# EAGLE design equ (EAGLE 9.1.2)
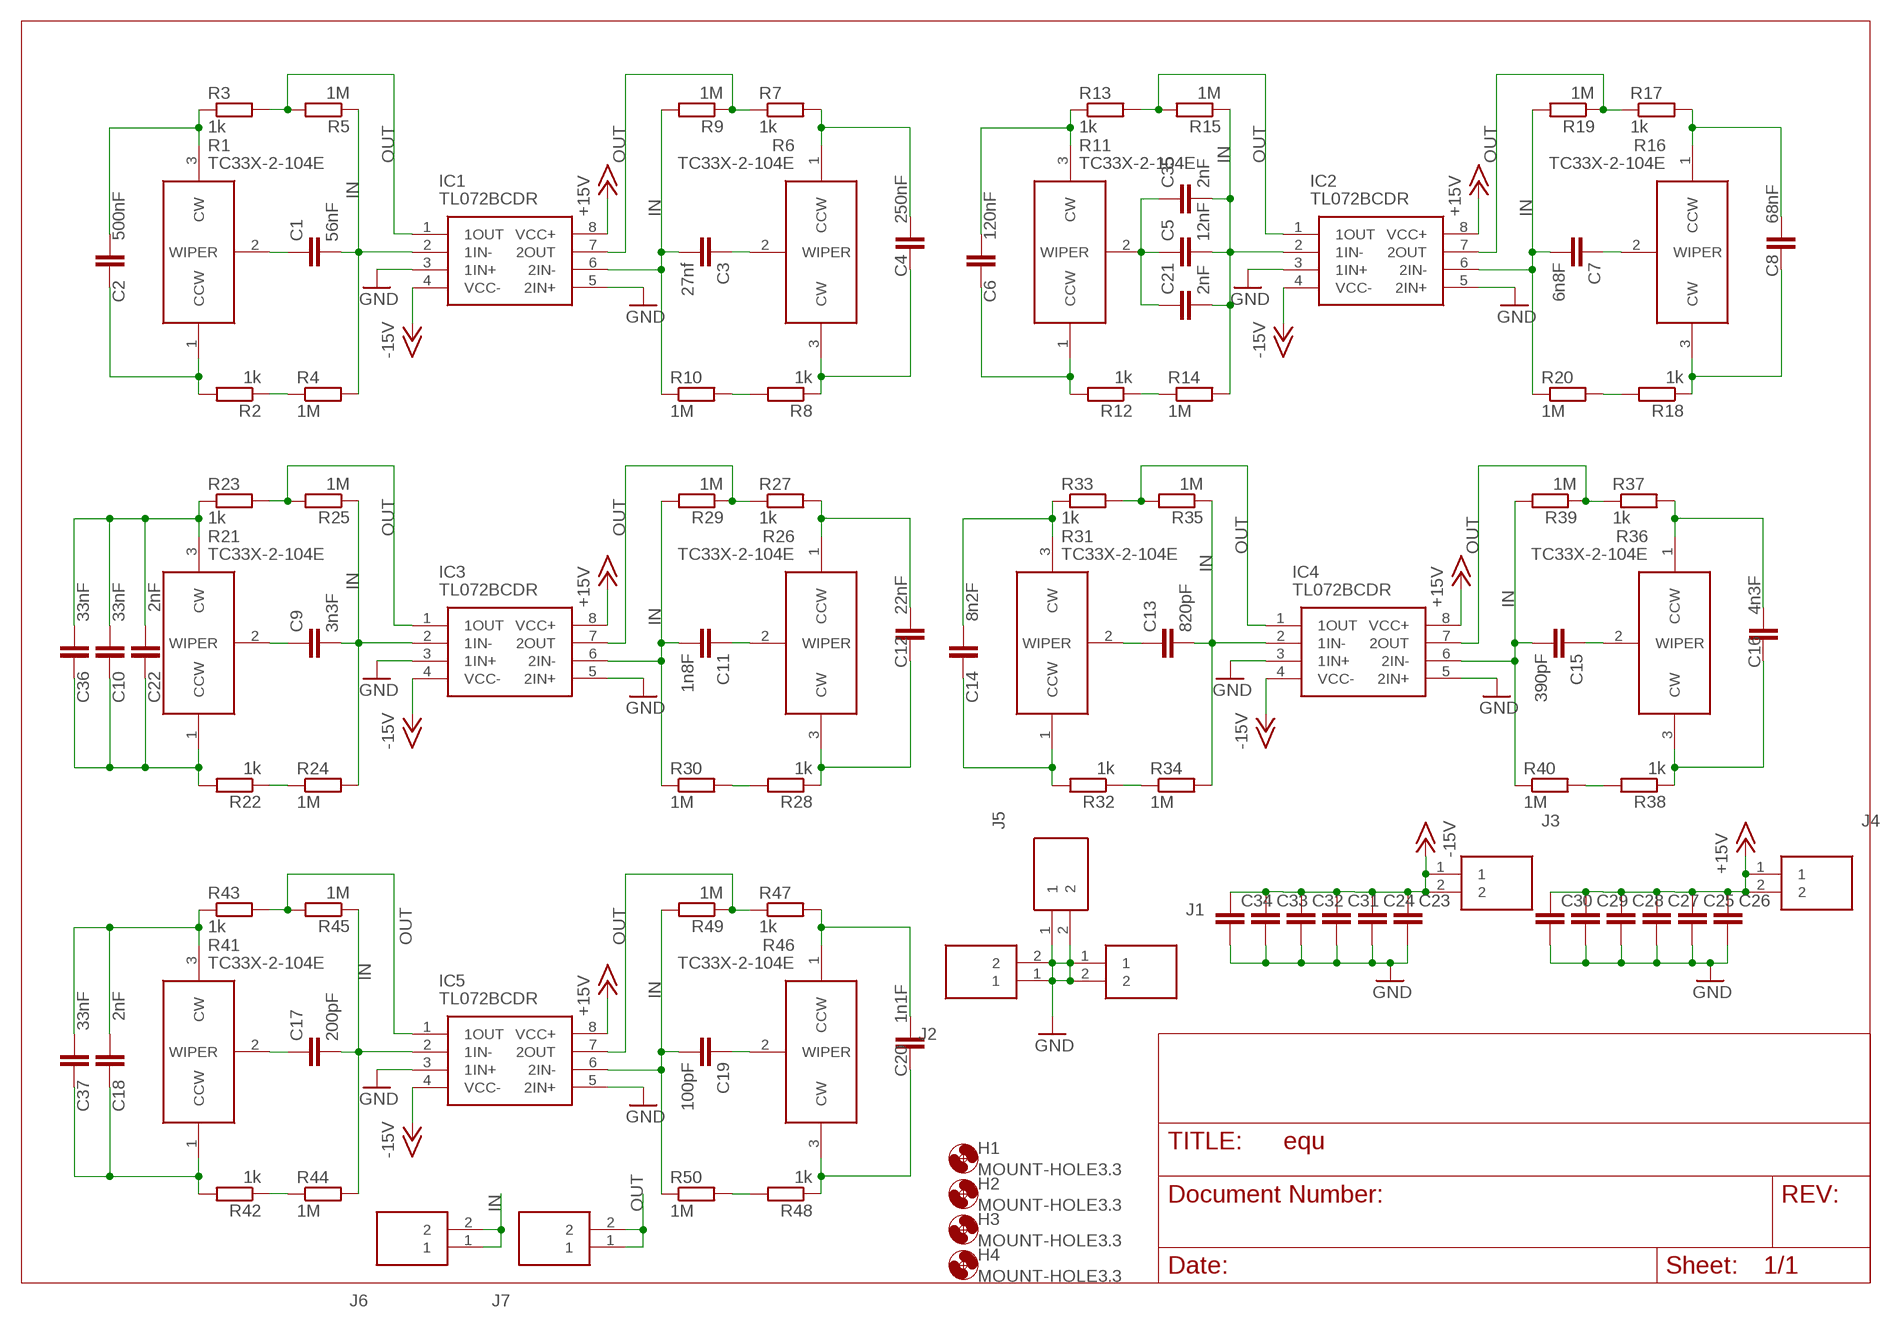
[diagram p0: schematic, sheet 1]

## Parts
C1  56nF  C-EUC0805  [C0805]
C2  500nF  C-EUC0805  [C0805]
C3  27nf  C-EUC0805  [C0805]
C4  250nF  C-EUC0805  [C0805]
C5  12nF  C-EUC0805  [C0805]
C6  120nF  C-EUC0805  [C0805]
C7  6n8F  C-EUC0805  [C0805]
C8  68nF  C-EUC0805  [C0805]
C9  3n3F  C-EUC0805  [C0805]
C10  33nF  C-EUC0805  [C0805]
C11  1n8F  C-EUC0805  [C0805]
C12  22nF  C-EUC0805  [C0805]
C13  820pF  C-EUC0805  [C0805]
C14  8n2F  C-EUC0805  [C0805]
C15  390pF  C-EUC0805  [C0805]
C16  4n3F  C-EUC0805  [C0805]
C17  200pF  C-EUC0805  [C0805]
C18  2nF  C-EUC0805  [C0805]
C19  100pF  C-EUC0805  [C0805]
C20  1n1F  C-EUC0805  [C0805]
C21  2nF  C-EUC0805  [C0805]
C22  2nF  C-EUC0805  [C0805]
C23  C-EUC0805  [C0805]
C24  C-EUC0805  [C0805]
C25  C-EUC0805  [C0805]
C26  C-EUC0805  [C0805]
C27  C-EUC0805  [C0805]
C28  C-EUC0805  [C0805]
C29  C-EUC0805  [C0805]
C30  C-EUC0805  [C0805]
C31  C-EUC0805  [C0805]
C32  C-EUC0805  [C0805]
C33  C-EUC0805  [C0805]
C34  C-EUC0805  [C0805]
C35  2nF  C-EUC0805  [C0805]
C36  33nF  C-EUC0805  [C0805]
C37  33nF  C-EUC0805  [C0805]
H1  MOUNT-HOLE3.3  [3,3]
H2  MOUNT-HOLE3.3  [3,3]
H3  MOUNT-HOLE3.3  [3,3]
H4  MOUNT-HOLE3.3  [3,3]
IC1  TL072BCDR  [SOIC127P600X175-8N]
IC2  TL072BCDR  [SOIC127P600X175-8N]
IC3  TL072BCDR  [SOIC127P600X175-8N]
IC4  TL072BCDR  [SOIC127P600X175-8N]
IC5  TL072BCDR  [SOIC127P600X175-8N]
J1  69190-402HLF  [HDRV2W90P0X254_1X2_508X241X858]
J2  69190-402HLF  [HDRV2W90P0X254_1X2_508X241X858]
J3  69190-402HLF  [HDRV2W90P0X254_1X2_508X241X858]
J4  69190-402HLF  [HDRV2W90P0X254_1X2_508X241X858]
J5  69190-402HLF  [HDRV2W90P0X254_1X2_508X241X858]
J6  69190-402HLF  [HDRV2W90P0X254_1X2_508X241X858]
J7  69190-402HLF  [HDRV2W90P0X254_1X2_508X241X858]
R1  TC33X-2-104E  [TC33X-2]
R2  1k  R-EU_R0805  [R0805]
R3  1k  R-EU_R0805  [R0805]
R4  1M  R-EU_R0805  [R0805]
R5  1M  R-EU_R0805  [R0805]
R6  TC33X-2-104E  [TC33X-2]
R7  1k  R-EU_R0805  [R0805]
R8  1k  R-EU_R0805  [R0805]
R9  1M  R-EU_R0805  [R0805]
R10  1M  R-EU_R0805  [R0805]
R11  TC33X-2-104E  [TC33X-2]
R12  1k  R-EU_R0805  [R0805]
R13  1k  R-EU_R0805  [R0805]
R14  1M  R-EU_R0805  [R0805]
R15  1M  R-EU_R0805  [R0805]
R16  TC33X-2-104E  [TC33X-2]
R17  1k  R-EU_R0805  [R0805]
R18  1k  R-EU_R0805  [R0805]
R19  1M  R-EU_R0805  [R0805]
R20  1M  R-EU_R0805  [R0805]
R21  TC33X-2-104E  [TC33X-2]
R22  1k  R-EU_R0805  [R0805]
R23  1k  R-EU_R0805  [R0805]
R24  1M  R-EU_R0805  [R0805]
R25  1M  R-EU_R0805  [R0805]
R26  TC33X-2-104E  [TC33X-2]
R27  1k  R-EU_R0805  [R0805]
R28  1k  R-EU_R0805  [R0805]
R29  1M  R-EU_R0805  [R0805]
R30  1M  R-EU_R0805  [R0805]
R31  TC33X-2-104E  [TC33X-2]
R32  1k  R-EU_R0805  [R0805]
R33  1k  R-EU_R0805  [R0805]
R34  1M  R-EU_R0805  [R0805]
R35  1M  R-EU_R0805  [R0805]
R36  TC33X-2-104E  [TC33X-2]
R37  1k  R-EU_R0805  [R0805]
R38  1k  R-EU_R0805  [R0805]
R39  1M  R-EU_R0805  [R0805]
R40  1M  R-EU_R0805  [R0805]
R41  TC33X-2-104E  [TC33X-2]
R42  1k  R-EU_R0805  [R0805]
R43  1k  R-EU_R0805  [R0805]
R44  1M  R-EU_R0805  [R0805]
R45  1M  R-EU_R0805  [R0805]
R46  TC33X-2-104E  [TC33X-2]
R47  1k  R-EU_R0805  [R0805]
R48  1k  R-EU_R0805  [R0805]
R49  1M  R-EU_R0805  [R0805]
R50  1M  R-EU_R0805  [R0805]

## Nets
+15V: C25.1 C26.1 C27.1 C28.1 C29.1 C30.1 IC1.8(VCC+) IC2.8(VCC+) IC3.8(VCC+) IC4.8(VCC+) IC5.8(VCC+) J4.1 J4.2
-15V: C23.1 C24.1 C31.1 C32.1 C33.1 C34.1 IC1.4(VCC-) IC2.4(VCC-) IC3.4(VCC-) IC4.4(VCC-) IC5.4(VCC-) J3.1 J3.2
GND: C23.2 C24.2 C25.2 C26.2 C27.2 C28.2 C29.2 C30.2 C31.2 C32.2 C33.2 C34.2 IC1.3(1IN+) IC1.5(2IN+) IC2.3(1IN+) IC2.5(2IN+) IC3.3(1IN+) IC3.5(2IN+) IC4.3(1IN+) IC4.5(2IN+) IC5.3(1IN+) IC5.5(2IN+) J1.1 J1.2 J2.1 J2.2 J5.1 J5.2
IN: C1.2 C3.2 C5.2 C7.2 C9.2 C11.2 C13.2 C15.2 C17.2 C19.2 C21.2 C35.2 IC1.2(1IN-) IC1.6(2IN-) IC2.2(1IN-) IC2.6(2IN-) IC3.2(1IN-) IC3.6(2IN-) IC4.2(1IN-) IC4.6(2IN-) IC5.2(1IN-) IC5.6(2IN-) J6.1 J6.2 R4.2 R5.1 R9.2 R10.1 R14.2 R15.1 R19.2 R20.1 R24.2 R25.1 R29.2 R30.1 R34.2 R35.1 R39.2 R40.1 R44.2 R45.1 R49.2 R50.1
N$1: C2.1 R1.1(CCW) R2.2
N$2: C2.2 R1.3(CW) R3.1
N$3: C1.1 R1.2(WIPER)
N$5: R2.1 R4.1
N$6: C6.1 R11.1(CCW) R12.2
N$7: C4.1 R6.1(CCW) R7.2
N$8: C4.2 R6.3(CW) R8.1
N$9: C3.1 R6.2(WIPER)
N$11: C6.2 R11.3(CW) R13.1
N$12: R8.2 R10.2
N$15: C5.1 C21.1 C35.1 R11.2(WIPER)
N$17: R12.1 R14.1
N$18: C8.1 R16.1(CCW) R17.2
N$19: C8.2 R16.3(CW) R18.1
N$20: C7.1 R16.2(WIPER)
N$22: R18.2 R20.2
N$25: C18.1 C37.1 R41.1(CCW) R42.2
N$26: C18.2 C37.2 R41.3(CW) R43.1
N$27: C9.1 R21.2(WIPER)
N$29: R22.1 R24.1
N$30: C12.1 R26.1(CCW) R27.2
N$31: C12.2 R26.3(CW) R28.1
N$32: C11.1 R26.2(WIPER)
N$34: R28.2 R30.2
N$37: C14.1 R31.1(CCW) R32.2
N$38: C14.2 R31.3(CW) R33.1
N$39: C13.1 R31.2(WIPER)
N$41: R32.1 R34.1
N$42: C16.1 R36.1(CCW) R37.2
N$43: C16.2 R36.3(CW) R38.1
N$44: C15.1 R36.2(WIPER)
N$46: R38.2 R40.2
N$51: C17.1 R41.2(WIPER)
N$53: R42.1 R44.1
N$54: C20.1 R46.1(CCW) R47.2
N$55: C20.2 R46.3(CW) R48.1
N$56: C19.1 R46.2(WIPER)
N$58: R48.2 R50.2
N$61: C10.1 C22.2 C36.1 R21.1(CCW) R22.2
N$62: C10.2 C22.1 C36.2 R21.3(CW) R23.1
OUT: IC1.1(1OUT) IC1.7(2OUT) IC2.1(1OUT) IC2.7(2OUT) IC3.1(1OUT) IC3.7(2OUT) IC4.1(1OUT) IC4.7(2OUT) IC5.1(1OUT) IC5.7(2OUT) J7.1 J7.2 R3.2 R5.2 R7.1 R9.1 R13.2 R15.2 R17.1 R19.1 R23.2 R25.2 R27.1 R29.1 R33.2 R35.2 R37.1 R39.1 R43.2 R45.2 R47.1 R49.1

## Library data of the parts
C1-C20 C36 C37 = rcl:C-EU: CAPACITOR, European symbol; SPICEPREFIX: C
C21-C35 = rcl-vito:C-EU: CAPACITOR, European symbol
H1-H4 = holes:MOUNT-HOLE: MOUNTING HOLE with drill center marker
IC1-IC5 = TL072BCDR:TL072BCDR: Dual low-noise JFET-input low offset operational amplifier Source: Datasheet <http://www.ti.com/lit/gpn/tl072b>; DESCRIPTION: Dual low-noise JFET-input low offset operational amplifier; HEIGHT: 1.75mm; MANUFACTURER_NAME: Texas Instruments; MANUFACTURER_PART_NUMBER: TL072BCDR; MOUSER_PART_NUMBER: 595-TL072BCDR; MOUSER_PRICE-STOCK: https://www.mouser.co.uk/ProductDetail/Texas-Instruments/TL072BCDR?qs=odmYgEirbwyOLHKvwmd6sw%3D%3D
J1-J7 = 69190-402HLF:69190-402HLF: FCI,Header 2 way unshrouded FCI, Series Number 69190, 2.54mm Pitch 2 Way 1 Row Straight Header, Solder Termination Source: Datasheet <https://cdn.amphenol-icc.com/media/wysiwyg/files/drawing/69190.pdf>; ALLIED_NUMBER: 70302517; ALLIED_PRICE-STOCK: https://www.alliedelec.com/amphenol-fci-69190-402hlf/70302517/; ARROW_PART_NUMBER: 69190-402HLF; ARROW_PRICE-STOCK: https://www.arrow.com/en/products/69190-402hlf/amphenol-fci; DESCRIPTION: FCI,Header 2 way unshrouded FCI, Series Number 69190, 2.54mm Pitch 2 Way 1 Row Straight Header, Solder Termination; HEIGHT: 8.58mm; MANUFACTURER_NAME: FCI; MANUFACTURER_PART_NUMBER: 69190-402HLF; RS_PART_NUMBER: 8632731; RS_PRICE-STOCK: http://uk.rs-online.com/web/p/products/8632731
R1 R6 R11 R16 R21 R26 R31 R36 R41 R46 = TC33X-2-104E:TC33X-2-104E: Cermet 3mm SMT trimmer,0.1W 100k Bourns TC33 Series SMD Cermet Trimmer Resistor with Solder Pad Terminations, 100k +/-25% 1/10W +/-250ppm/C Top Adjust Source: Datasheet <https://componentsearchengine.com//TC33X-2-104E.pdf>; DESCRIPTION: Cermet 3mm SMT trimmer,0.1W 100k Bourns TC33 Series SMD Cermet Trimmer Resistor with Solder Pad Terminations, 100k +/-25% 1/10W +/-250ppm/C Top Adjust; HEIGHT: mm; MANUFACTURER_NAME: Bourns; MANUFACTURER_PART_NUMBER: TC33X-2-104E; MOUSER2_PART_NUMBER: 652-TC33X-2-104E; MOUSER2_PRICE-STOCK: https://www.mouser.com/Search/Refine.aspx?Keyword=652-TC33X-2-104E
R2-R5 R7-R10 R12-R15 R17-R20 R22-R25 R27-R30 R32-R35 R37-R40 R42-R45 R47-R50 = rcl:R-EU_: RESISTOR, European symbol; SPICEPREFIX: R

## Board
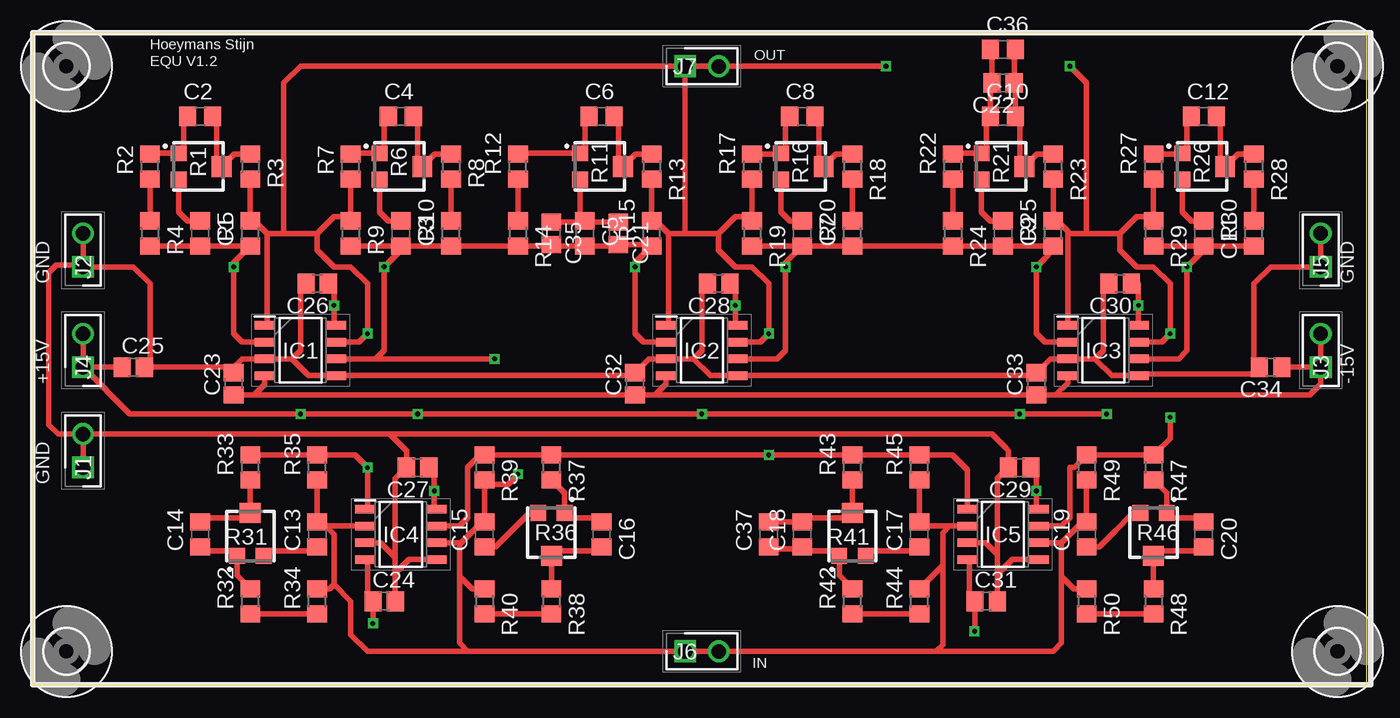
[diagram p1: board, top side]
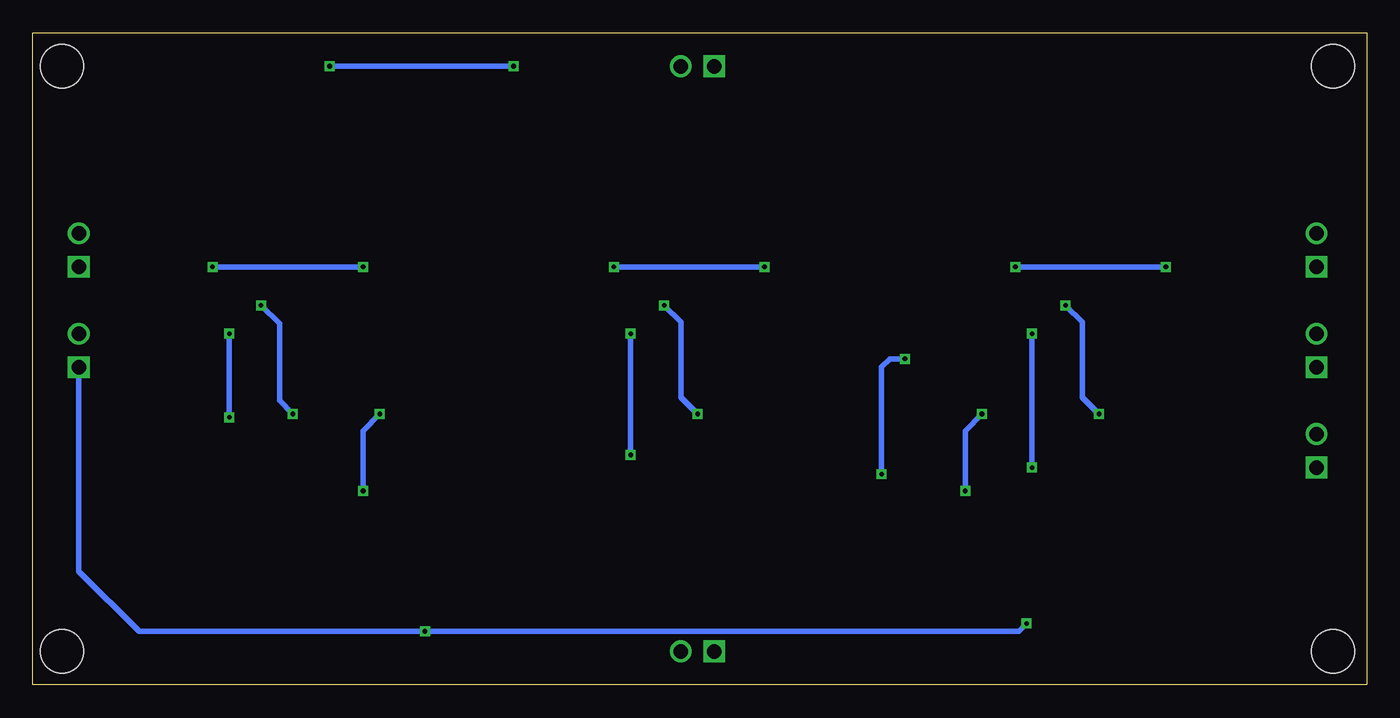
[diagram p2: board, bottom side, seen from below]

Size 101.27 x 49.52 mm. Coordinates in mm from the lower left corner, seen from the top.
Outline: 0,0 101.27,0 101.27,49.52 0,49.52 0,0
Copper layers (1*16): Top 0.035mm / dielectric 1.5mm / Bottom 0.035mm
Design rules "default": minimum track width 6mil, minimum drill 0.35mm, track to track 6mil, track to pad 6mil, pad to pad 6mil, via to via 6mil, smd to smd 6mil, copper to edge 40mil, drill to drill 6mil, minimum pad ring 10mil, minimum via ring 8mil, stop-mask expansion 4mil, vias tented up to drill 0mil, thermal gap 10mil

### Footprints (pad centres in the part's own frame; a part is rotated, then mirrored left to right if it is on the bottom)
C0805 = smd 1.3 x 1.5: 1 -0.95,0; 2 0.95,0
C0805' = smd 1.3 x 1.5: 1 -0.85,0; 2 0.85,0
3,3 = hole 3.3: 0,0
SOIC127P600X175-8N = smd 1.528 x 0.65: 1 -2.711,1.905; 2 -2.711,0.635; 3 -2.711,-0.635; 4 -2.711,-1.905; 5 2.711,-1.905; 6 2.711,-0.635; 7 2.711,0.635; 8 2.711,1.905
HDRV2W90P0X254_1X2_508X241X858 = drill 1.1 pad 1.65 square: 1 0,0 | drill 1.1 pad 1.65: 2 2.54,0
TC33X-2 = smd 1.2 x 1.2: 1 -1,-1.625; 2 1,-1.625 | smd 1.6 x 1.5: 3 0,1.625
R0805 = smd 1.3 x 1.5: 1 -0.95,0; 2 0.95,0

### Placement (x,y rotation side)
C1  12.7,34.29 270 top
C2  12.7,43.18 0 top
C3  27.94,34.29 270 top
C4  27.94,43.18 0 top
C5  41.91,34.29 270 top
C6  43.18,43.18 0 top
C7  58.42,34.29 270 top
C8  58.42,43.18 0 top
C9  73.66,34.29 270 top
C10  73.66,43.18 0 top
C11  88.9,34.29 270 top
C12  88.9,43.18 0 top
C13  21.59,11.43 90 top
C14  12.7,11.43 90 top
C15  34.29,11.43 90 top
C16  43.18,11.43 270 top
C17  67.31,11.43 90 top
C18  58.42,11.43 90 top
C19  80.01,11.43 90 top
C20  88.9,11.43 270 top
C21  2nF  [C0805']  44.45,34.29 270 top
C22  2nF  [C0805']  73.66,45.72 180 top
C23  [C0805']  15.24,22.86 90 top
C24  [C0805']  26.67,6.35 0 top
C25  [C0805']  7.62,24.13 0 top
C26  [C0805']  21.59,30.48 180 top
C27  [C0805']  29.21,16.51 180 top
C28  [C0805']  52.07,30.48 180 top
C29  [C0805']  74.93,16.51 180 top
C30  [C0805']  82.55,30.48 180 top
C31  [C0805']  72.39,6.35 0 top
C32  [C0805']  45.72,22.86 90 top
C33  [C0805']  76.2,22.86 90 top
C34  [C0805']  93.98,24.13 180 top
C35  2nF  [C0805']  39.37,34.29 270 top
C36  73.66,48.26 0 top
C37  55.88,11.43 90 top
H1  2.54,46.99 0 top
H2  99.06,46.99 0 top
H3  99.06,2.54 0 top
H4  2.54,2.54 0 top
IC1  20.32,25.4 0 top
IC2  50.8,25.4 0 top
IC3  81.28,25.4 0 top
IC4  27.94,11.43 0 top
IC5  73.66,11.43 0 top
J1  3.81,16.51 90 top
J2  3.81,31.75 90 top
J3  97.79,24.13 90 top
J4  3.81,24.13 90 top
J5  97.79,31.75 90 top
J6  49.53,2.54 0 top
J7  49.53,46.99 0 top
R1  12.7,39.37 270 top
R2  8.89,39.37 90 top
R3  16.51,39.37 270 top
R4  8.89,34.29 270 top
R5  16.51,34.29 90 top
R6  27.94,39.37 270 top
R7  24.13,39.37 90 top
R8  31.75,39.37 270 top
R9  24.13,34.29 270 top
R10  31.75,34.29 90 top
R11  43.18,39.37 270 top
R12  36.83,39.37 90 top
R13  46.99,39.37 270 top
R14  36.83,34.29 270 top
R15  46.99,34.29 90 top
R16  58.42,39.37 270 top
R17  54.61,39.37 90 top
R18  62.23,39.37 270 top
R19  54.61,34.29 270 top
R20  62.23,34.29 90 top
R21  73.66,39.37 270 top
R22  69.85,39.37 90 top
R23  77.47,39.37 270 top
R24  69.85,34.29 270 top
R25  77.47,34.29 90 top
R26  88.9,39.37 270 top
R27  85.09,39.37 90 top
R28  92.71,39.37 270 top
R29  85.09,34.29 270 top
R30  92.71,34.29 90 top
R31  16.51,11.43 0 top
R32  16.51,6.35 90 top
R33  16.51,16.51 90 top
R34  21.59,6.35 90 top
R35  21.59,16.51 90 top
R36  39.37,11.43 180 top
R37  39.37,16.51 270 top
R38  39.37,6.35 270 top
R39  34.29,16.51 270 top
R40  34.29,6.35 270 top
R41  62.23,11.43 0 top
R42  62.23,6.35 90 top
R43  62.23,16.51 90 top
R44  67.31,6.35 90 top
R45  67.31,16.51 90 top
R46  85.09,11.43 180 top
R47  85.09,16.51 270 top
R48  85.09,6.35 270 top
R49  80.01,16.51 270 top
R50  80.01,6.35 270 top

### Tracks (layer width: path | path; a pad name or v marks a point on that pad's centre or on a via)
+15V  (via drill 0.35)
  Top 0.406: IC1.8 22.86,27.48 22.86,27.94 v22.86,28.83 22.86,30.48 C26.1 | 7.2,24.13 C25.1 J4.1 | J4.1 J4.2 | IC2.8 53.34,27.48 v53.34,28.83 53.34,30.48 C28.1 | C27.1 30.48,16.09 v30.48,14.73 30.48,13.51 IC4.8 | IC5.8 76.2,13.51 v76.2,14.73 76.2,16.51 C29.1 | IC3.8 83.95,27.35 v83.95,28.83 83.95,30.48 C30.1 | v81.53,20.57 v74.93,20.57 v50.8,20.57 | v50.8,20.57 49.53,20.57 | 49.53,20.57 v29.21,20.57 v20.32,20.57 7.37,20.57 J4.1 | v50.8,20.57 49.53,20.57
  Bottom 0.406: v83.95,28.83 82.55,27.43 82.55,21.59 v81.53,20.57 | v53.34,28.83 52.07,27.56 52.07,21.84 v50.8,20.57 | v22.86,28.83 21.59,27.56 21.59,21.84 v20.32,20.57 | v30.48,14.73 30.48,19.3 v29.21,20.57 | v76.2,14.73 76.2,19.3 v74.93,20.57
-15V  (via drill 0.35)
  Top 0.406: IC1.4 17.61,22.82 16.8,22.01 C23.1 C32.1 | IC4.4 25.4,9.35 25.4,6.77 C24.1 v25.82,4.66 | IC5.4 71.12,9.35 71.12,6.35 C31.1 71.54,5.08 | 71.54,4.74 71.54,5.08 | J3.1 97.79,22.86 96.94,22.01 77.47,22.01 | 47.2,22.01 46.99,22.01 | 46.99,22.01 C32.1 | C34.1 J3.1 | IC2.4 48.09,22.86 47.54,22.31 | 47.24,22.02 47.54,22.31 | IC3.4 78.57,22.94 77.64,22.01 77.47,22.01 | 77.47,22.01 C33.1 46.99,22.01 | 46.99,22.01 C32.1 | J3.2 J3.1 | 46.99,22.01 47.54,22.01 47.54,22.31 | 71.54,5.08 71.54,4.1 v71.5,4.06
  Bottom 0.406: J3.1 97.79,23.75 | 97.79,23.75 97.79,22.86 | 97.79,22.86 | v25.82,4.66 26.42,4.06 v71.5,4.06 93.22,4.06 97.79,8.64 97.79,23.75
GND
  Top 0.406: 19.68,24.77 19.05,24.77 IC1.3 15.88,24.77 15.03,23.92 | 19.68,24.77 20.32,25.4 20.32,30.48 C26.2 | 15.03,23.92 14.82,24.13 C25.2 8.89,24.55 8.89,30.48 7.62,31.75 J2.1 3.81,31.88 | 15.03,23.92 C23.2 | C24.2 27.52,7.62 | 27.52,7.62 27.52,8.47 28.57,9.52 29.21,9.52 IC4.5 | IC4.3 26.42,10.8 27.52,9.69 27.52,8.89 | 27.52,8.89 27.52,7.62 | IC2.3 48.26,24.77 | 48.26,24.77 50.16,24.77 | 50.16,24.77 50.8,25.4 50.8,30.48 C28.2 | IC3.3 78.74,24.77 | 78.74,24.77 80.64,24.77 | 80.64,24.77 81.28,25.4 81.28,30.48 C30.2 | 27.52,8.89 27.52,15.67 C27.2 28.36,17.78 | C29.2 74.08,16.09 | C31.2 73.24,8.38 | 73.24,8.38 73.24,9.91 | 73.24,9.91 73.24,15.67 C29.2 | IC5.3 72.35,10.8 73.24,9.91 | IC5.5 74.38,9.52 73.24,8.38 | 48.26,24.77 46.77,24.77 C32.2 45.51,23.49 IC1.5 20.95,23.49 19.68,24.77 | 78.74,24.77 77.25,24.77 C33.2 75.98,23.49 IC2.5 51.44,23.49 50.16,24.77 | 3.81,31.88 J2.2 | J5.2 J5.1 93.98,31.75 92.71,30.48 92.71,24.55 C34.2 93.13,24.04 92.71,23.62 84.12,23.62 IC3.5 81.92,23.49 80.64,24.77 | J1.1 J1.2 | 7.62,19.05 6.35,19.05 | 6.35,19.05 J1.2 | 28.36,17.79 28.36,17.78 | C29.2 74.08,17.78 73.87,17.99 72.81,19.05 26.67,19.05 | J1.2 1.91,19.05 1.22,19.74 1.22,31.32 1.78,31.88 3.81,31.88 | 6.35,19.05 26.67,19.05 | 28.36,17.78 27.09,19.05 26.67,19.05
IN  (via drill 0.35)
  Top 0.406: R45.1 67.31,12.7 C17.2 67.62,12.06 69.85,12.06 | R49.2 C19.2 79.69,12.38 78.11,10.8 | IC5.6 78.11,10.8 | 78.11,10.8 78.11,8.26 | R50.1 79.06,7.3 78.11,8.26 | C11.2 R29.2 | C11.2 R30.1 | IC3.6 87,24.77 87.63,25.4 v87.63,31.75 88.9,33.02 C11.2 | C15.2 34.29,12.7 | 34.29,12.7 34.29,15.24 | 34.29,15.24 R39.2 | 31.75,10.8 32.38,10.8 | 31.75,10.8 IC4.6 | 31.75,10.8 32.51,10.8 | 34.29,12.7 34.29,12.57 32.51,10.8 | R40.1 33.34,7.3 33.02,7.62 32.38,8.26 32.38,8.89 | C7.2 R20.1 R24.2 C9.2 R25.1 77.31,33.18 77.31,32.86 76.83,32.39 | C7.2 R19.2 | IC2.6 56.52,24.77 57.15,25.4 v57.15,31.75 57.15,32.07 C7.2 | R9.2 C3.2 | C3.2 R10.1 R14.2 39.37,33.34 | C3.2 27.94,33.02 v26.67,31.75 26.67,25.4 26.04,24.77 IC1.6 v35.05,24.77 | R4.2 C1.2 R5.1 15.24,32.07 v15.24,31.75 15.24,26.67 15.88,26.03 IC1.2 | 39.37,33.34 C5.2 44.35,33.34 C21.2 46.89,33.44 R15.1 45.72,32.07 v45.72,31.75 45.72,29.21 45.72,26.67 46.35,26.03 IC2.2 | C35.2 39.37,33.34 | IC3.2 76.83,26.03 76.2,26.67 v76.2,31.75 | 21.59,12.7 C13.2 21.91,12.06 IC4.2 | 21.59,12.7 R35.1 | R34.2 22.54,7.3 22.86,7.62 | 22.86,7.62 22.86,11.43 21.59,12.7 | 22.86,7.62 24.13,6.35 24.13,3.81 25.4,2.54 33.02,2.54 | 33.02,2.54 36.83,2.54 | 36.83,2.54 J6.1 J6.2 68.58,2.54 | 33.02,2.54 36.83,2.54 | R44.2 69.09,9.08 | 69.85,12.06 69.6,12.06 69.09,11.56 69.09,9.08 | 69.85,12.06 IC5.2 | 32.38,8.89 32.38,10.67 32.51,10.8 | 32.38,8.89 32.38,3.17 33.02,2.54 | 68.58,2.54 77.47,2.54 78.11,3.17 78.11,8.26 | 69.09,9.08 69.09,3.05 68.58,2.54 | v76.2,31.75 76.83,32.39 | v76.2,31.75 76.83,32.39 | v36.83,16 36.07,15.24 34.29,15.24
  Bottom 0.406: v45.72,31.75 v57.15,31.75 | v26.67,31.75 v15.24,31.75 | v76.2,31.75 v87.63,31.75 | v35.05,24.77 36.2,24.77 36.83,24.13 v36.83,16
N$1
  Top 0.406: C2.1 11.43,43.18 11.43,40.72 R1.1 8.94,40.37 R2.2
N$2
  Top 0.406: C2.2 13.97,43.18 13.97,39.72 R1.3 15.28,40.32 R3.1
N$3
  Top 0.406: R1.2 11.07,35.92 11.75,35.24 C1.1
N$5
  Top 0.406: R2.1 R4.1
N$6
  Top 0.406: R12.2 36.88,40.37 R11.1 41.91,40.72 41.91,43.18 C6.1
N$7
  Top 0.406: C4.1 26.67,42.86 26.67,40.64 26.4,40.37 R6.1 24.18,40.37 R7.2
N$8
  Top 0.406: R8.1 30.52,40.32 R6.3 29.21,39.72 29.21,43.18 C4.2
N$9
  Top 0.406: R6.2 26.32,35.92 26.99,35.24 C3.1
N$11
  Top 0.406: R13.1 45.76,40.32 R11.3 44.45,39.72 44.45,43.18 C6.2
N$12
  Top 0.406: R10.2 R8.2
N$15
  Top 0.406: R11.2 41.55,35.59 C5.1 | C21.1 42.01,35.14 C5.1 | C35.1 41.81,35.14 C5.1
N$17
  Top 0.406: R14.1 R12.1
N$18
  Top 0.406: R17.2 56.74,40.32 R16.1 57.15,40.72 57.15,43.18 C8.1
N$19
  Top 0.406: C8.2 59.69,43.18 59.69,39.72 R16.3 60.99,40.32 R18.1
N$20
  Top 0.406: R16.2 56.8,35.92 57.47,35.24 C7.1
N$22
  Top 0.406: R18.2 R20.2
N$25
  Top 0.406: C18.1 58.58,10.32 | 58.58,10.32 58.74,10.16 60.96,10.16 61.23,9.89 R41.1 61.23,8.3 R42.2 | C37.1 56.04,10.32 58.58,10.32
N$26
  Top 0.406: R43.1 R41.3 61.88,12.7 58.42,12.7 C18.2 C37.2
N$27
  Top 0.406: R21.2 72.03,35.92 72.71,35.24 C9.1
N$29
  Top 0.406: R22.1 R24.1
N$30
  Top 0.406: R27.2 87.22,40.32 R26.1 87.63,40.72 87.63,43.18 C12.1
N$31
  Top 0.406: R28.1 91.47,40.32 R26.3 90.17,39.72 90.17,43.18 C12.2
N$32
  Top 0.406: R26.2 87.28,35.92 87.95,35.24 C11.1
N$34
  Top 0.406: R30.2 R28.2
N$37
  Top 0.406: C14.1 12.7,10.16 15.15,10.16 R31.1 15.51,8.3 R32.2
N$38
  Top 0.406: R33.1 R31.3 16.16,12.7 12.7,12.7 C14.2
N$39
  Top 0.406: C13.1 21.27,10.16 17.78,10.16 17.51,9.89 R31.2
N$41
  Top 0.406: R32.1 R34.1
N$42
  Top 0.406: C16.1 42.86,12.7 40.64,12.7 40.37,12.97 R36.1 40.37,14.56 R37.2
N$43
  Top 0.406: R38.1 R36.3 39.73,10.16 43.18,10.16 C16.2
N$44
  Top 0.406: C15.1 35.12,10.48 37.69,13.05 R36.2
N$46
  Top 0.406: R40.2 R38.2
N$51
  Top 0.406: C17.1 66.99,10.16 63.5,10.16 63.23,9.89 R41.2
N$53
  Top 0.406: R42.1 R44.1
N$54
  Top 0.406: R47.2 86.09,14.56 R46.1 86.44,12.7 88.9,12.7 C20.1
N$55
  Top 0.406: C20.2 88.9,10.16 85.44,10.16 R46.3 R48.1
N$56
  Top 0.406: 83.82,12.7 84.09,12.97 | 84.09,12.97 R46.2 | C19.1 80.97,10.48 82.23,11.75 83.45,12.97 84.09,12.97
N$58
  Top 0.406: R48.2 R50.2
N$61
  Top 0.406: R22.2 69.9,40.37 R21.1 72.39,40.72 72.39,43.18 C10.1 72.71,45.62 C22.2 72.81,48.16 C36.1
N$62
  Top 0.406: R23.1 76.23,40.32 R21.3 74.93,39.72 74.93,43.18 C10.2 74.61,45.62 C22.1 74.51,48.16 C36.2
OUT  (via drill 0.35)
  Top 0.406: IC5.1 70.95,16.34 | 70.95,16.34 69.83,17.46 R45.2 R43.2 v55.88,17.46 R37.1 R39.1 33.97,17.46 33.02,16.51 33.02,12.7 32.38,12.06 IC4.7 | IC5.7 78.11,12.06 78.74,12.7 78.74,16.51 79.06,16.51 79.11,16.57 79.12,16.57 R49.1 R47.1 86.36,18.73 v86.36,20.32 | R25.2 77.47,35.56 | 77.47,35.56 R23.2 | IC3.1 78.57,30.48 78.57,32.54 78.58,32.54 78.58,34.29 | 78.58,34.29 78.58,34.45 77.47,35.56 | IC3.7 85.72,26.03 v86.36,26.67 86.36,30.48 85.09,31.75 83.82,31.75 82.55,33.02 82.55,34.29 | 82.55,34.29 83.82,35.56 84.77,35.56 R29.1 R27.1 | R5.2 16.51,35.56 | 16.51,35.56 R3.2 | IC1.1 17.78,27.48 17.78,34.29 | 17.78,34.29 16.51,35.56 | R9.1 24.13,35.56 | 24.13,35.56 R7.1 | IC1.7 24.77,26.03 v25.4,26.67 25.4,30.48 24.13,31.75 22.86,31.75 21.59,33.02 21.59,34.29 | 21.59,34.29 22.86,35.56 24.13,35.56 | IC2.1 48.26,27.48 48.26,34.29 | 48.26,34.29 46.99,35.56 R15.2 R13.2 | IC2.7 55.24,26.03 v55.88,26.67 55.88,30.48 54.61,31.75 53.34,31.75 52.07,33.02 52.07,34.29 | 52.07,34.29 53.34,35.56 54.29,35.56 R19.1 R17.1 | R33.2 R35.2 24.13,17.46 24.45,17.46 v25.4,16.51 25.4,13.51 IC4.1 | 21.59,34.29 19.05,34.29 | 19.05,34.29 17.78,34.29 | 52.07,34.29 49.53,34.29 | 49.53,34.29 48.26,34.29 | 82.55,34.29 80.01,34.29 | 80.01,34.29 78.58,34.29 | 19.05,34.29 19.05,45.72 20.32,46.99 J7.1 | 49.53,34.29 J7.1 | 63.5,46.99 v64.77,46.99 63.5,46.99 | 63.5,46.99 J7.2 J7.1 | 70.95,16.34 | 80.01,34.29 80.01,45.72 v78.74,46.99
  Bottom 0.406: v78.74,46.99 v64.77,46.99 | v86.36,26.67 v86.36,20.32 | v55.88,26.67 v55.88,17.46 | v25.4,26.67 v25.4,16.51

### Text on the board
tPlace: Hoeymans Stijn | OUT | EQU V1.2 | GND | GND | +15V | -15V | GND | IN